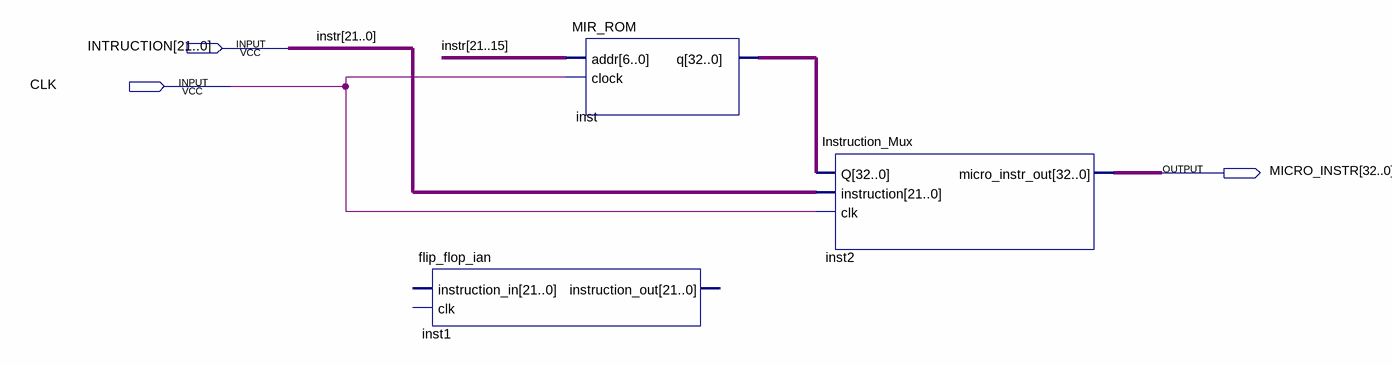
[diagram p0: schematic sheet]
// Quartus schematic MicroInstrGenerator.bdf as structural Verilog: 3 symbols, 3 pins
module MicroInstrGenerator (
  input  [21:0] INTRUCTION,
  input  CLK,
  output [32:0] MICRO_INSTR
);

  wire [32:0] inst_q;

  flip_flop_ian inst1 ();  // open: instruction_in, clk, instruction_out
  MIR_ROM inst (.addr(INTRUCTION[21:15]), .clock(CLK), .q(inst_q));
  Instruction_Mux inst2 (.Q(inst_q), .instruction(INTRUCTION), .clk(CLK), .micro_instr_out(MICRO_INSTR));

  // Other names for the same wires on the sheet: instr[21:0] = INTRUCTION
endmodule
